# Altium schematic sheet main.schdoc
size 209 x 297 mm
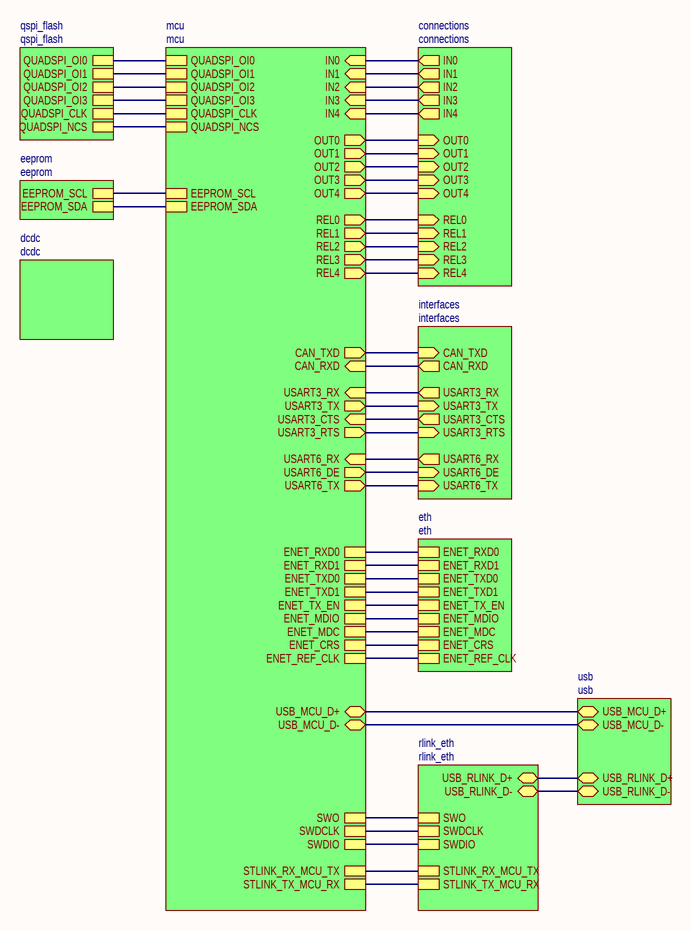
[diagram p0: main.schdoc]

## Sub-sheets
connections = connections: IN0 (out), IN1 (out), IN2 (out), IN3 (out), IN4 (out), OUT0 (in), OUT1 (in), OUT2 (in), OUT3 (in), OUT4 (in), REL0 (in), REL1 (in), REL2 (in), REL3 (in), REL4 (in)
dcdc = dcdc: no entries
eeprom = eeprom: EEPROM_SCL, EEPROM_SDA
eth = eth: ENET_RXD0, ENET_RXD1, ENET_TXD0, ENET_TXD1, ENET_TX_EN, ENET_MDIO, ENET_MDC, ENET_CRS, ENET_REF_CLK
interfaces = interfaces: CAN_TXD (in), CAN_RXD (out), USART3_RX (out), USART3_TX (in), USART3_CTS (out), USART3_RTS (in), USART6_RX (out), USART6_DE (in), USART6_TX (in)
mcu = mcu: IN0 (in), IN1 (in), IN2 (in), IN3 (in), IN4 (in), OUT0 (out), OUT1 (out), OUT2 (out), OUT3 (out), OUT4 (out), REL0 (out), REL1 (out), REL2 (out), REL3 (out), REL4 (out), CAN_TXD (out), CAN_RXD (in), USART3_RX (in), USART3_TX (out), USART3_CTS (in), USART3_RTS (out), USART6_RX (in), USART6_DE (out), USART6_TX (out), QUADSPI_OI0, QUADSPI_OI1, QUADSPI_OI2, QUADSPI_OI3, QUADSPI_CLK, QUADSPI_NCS, EEPROM_SCL, EEPROM_SDA, ENET_RXD0, ENET_RXD1, ENET_TXD0, ENET_TXD1, ENET_TX_EN, ENET_MDIO, ENET_MDC, ENET_CRS, USB_MCU_D+ (bidir), ENET_REF_CLK, SWO, SWDCLK, SWDIO, STLINK_RX_MCU_TX, STLINK_TX_MCU_RX, USB_MCU_D- (bidir)
qspi_flash = qspi_flash: QUADSPI_OI0, QUADSPI_OI1, QUADSPI_OI2, QUADSPI_OI3, QUADSPI_CLK, QUADSPI_NCS
rlink_eth = rlink_eth: USB_RLINK_D+ (bidir), USB_RLINK_D- (bidir), SWO, SWDCLK, SWDIO, STLINK_RX_MCU_TX, STLINK_TX_MCU_RX
usb = usb: USB_MCU_D+ (bidir), USB_MCU_D- (bidir), USB_RLINK_D+ (bidir), USB_RLINK_D- (bidir)

## Nets
(unnamed): sheet mcu/IN0, sheet connections/IN0
(unnamed): sheet mcu/IN1, sheet connections/IN1
(unnamed): sheet mcu/IN2, sheet connections/IN2
(unnamed): sheet mcu/IN3, sheet connections/IN3
(unnamed): sheet mcu/IN4, sheet connections/IN4
(unnamed): sheet mcu/OUT0, sheet connections/OUT0
(unnamed): sheet mcu/OUT1, sheet connections/OUT1
(unnamed): sheet mcu/OUT2, sheet connections/OUT2
(unnamed): sheet mcu/OUT3, sheet connections/OUT3
(unnamed): sheet mcu/OUT4, sheet connections/OUT4
(unnamed): sheet mcu/REL0, sheet connections/REL0
(unnamed): sheet mcu/REL1, sheet connections/REL1
(unnamed): sheet mcu/REL2, sheet connections/REL2
(unnamed): sheet mcu/REL3, sheet connections/REL3
(unnamed): sheet mcu/REL4, sheet connections/REL4
(unnamed): sheet mcu/CAN_TXD, sheet interfaces/CAN_TXD
(unnamed): sheet mcu/CAN_RXD, sheet interfaces/CAN_RXD
(unnamed): sheet mcu/USART3_RX, sheet interfaces/USART3_RX
(unnamed): sheet mcu/USART3_TX, sheet interfaces/USART3_TX
(unnamed): sheet mcu/USART3_CTS, sheet interfaces/USART3_CTS
(unnamed): sheet mcu/USART3_RTS, sheet interfaces/USART3_RTS
(unnamed): sheet mcu/USART6_RX, sheet interfaces/USART6_RX
(unnamed): sheet mcu/USART6_DE, sheet interfaces/USART6_DE
(unnamed): sheet mcu/USART6_TX, sheet interfaces/USART6_TX
(unnamed): sheet mcu/QUADSPI_OI0, sheet qspi_flash/QUADSPI_OI0
(unnamed): sheet mcu/QUADSPI_OI1, sheet qspi_flash/QUADSPI_OI1
(unnamed): sheet mcu/QUADSPI_OI2, sheet qspi_flash/QUADSPI_OI2
(unnamed): sheet mcu/QUADSPI_OI3, sheet qspi_flash/QUADSPI_OI3
(unnamed): sheet mcu/QUADSPI_CLK, sheet qspi_flash/QUADSPI_CLK
(unnamed): sheet mcu/QUADSPI_NCS, sheet qspi_flash/QUADSPI_NCS
(unnamed): sheet mcu/EEPROM_SCL, sheet eeprom/EEPROM_SCL
(unnamed): sheet mcu/EEPROM_SDA, sheet eeprom/EEPROM_SDA
(unnamed): sheet mcu/ENET_RXD0, sheet eth/ENET_RXD0
(unnamed): sheet mcu/ENET_RXD1, sheet eth/ENET_RXD1
(unnamed): sheet mcu/ENET_TXD0, sheet eth/ENET_TXD0
(unnamed): sheet mcu/ENET_TXD1, sheet eth/ENET_TXD1
(unnamed): sheet mcu/ENET_TX_EN, sheet eth/ENET_TX_EN
(unnamed): sheet mcu/ENET_MDIO, sheet eth/ENET_MDIO
(unnamed): sheet mcu/ENET_MDC, sheet eth/ENET_MDC
(unnamed): sheet mcu/ENET_CRS, sheet eth/ENET_CRS
(unnamed): sheet mcu/USB_MCU_D+, sheet usb/USB_MCU_D+
(unnamed): sheet mcu/ENET_REF_CLK, sheet eth/ENET_REF_CLK
(unnamed): sheet mcu/SWO, sheet rlink_eth/SWO
(unnamed): sheet mcu/SWDCLK, sheet rlink_eth/SWDCLK
(unnamed): sheet mcu/SWDIO, sheet rlink_eth/SWDIO
(unnamed): sheet mcu/STLINK_RX_MCU_TX, sheet rlink_eth/STLINK_RX_MCU_TX
(unnamed): sheet mcu/STLINK_TX_MCU_RX, sheet rlink_eth/STLINK_TX_MCU_RX
(unnamed): sheet mcu/USB_MCU_D-, sheet usb/USB_MCU_D-
(unnamed): sheet usb/USB_RLINK_D+, sheet rlink_eth/USB_RLINK_D+
(unnamed): sheet usb/USB_RLINK_D-, sheet rlink_eth/USB_RLINK_D-